# EAGLE design LPS25H_Breakout (EAGLE 7.4.0)
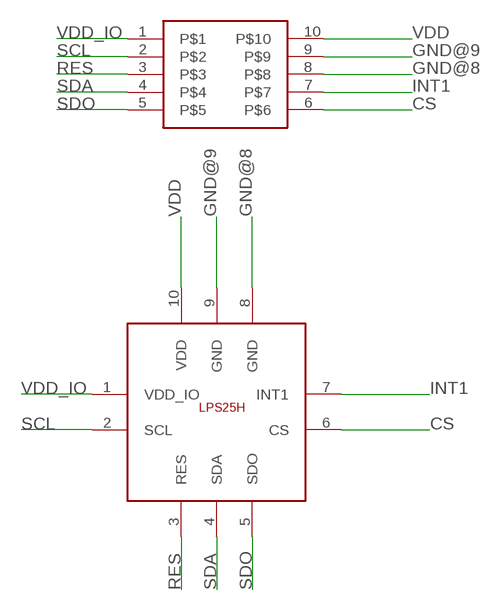
[diagram p0: schematic, sheet 1]

## Parts
U$1  ST-LPS25H  [ST-LPS25H]
U$2  10PIN  [10PIN]

## Nets
CS: U$1.6(CS) U$2.6
GND@8: U$1.8(GND) U$2.8
GND@9: U$1.9(GND) U$2.9
INT1: U$1.7(INT1) U$2.7
RES: U$1.3(RES) U$2.3
SCL: U$1.2(SCL) U$2.2
SDA: U$1.4(SDA) U$2.4
SDO: U$1.5(SDO) U$2.5
VDD: U$1.10(VDD) U$2.10
VDD_IO: U$1.1(VDD_IO) U$2.1

## Library data of the parts
U$1 = FaBo-Mems:ST-LPS25H
U$2 = FaBo-Breakout:10PIN

## Board
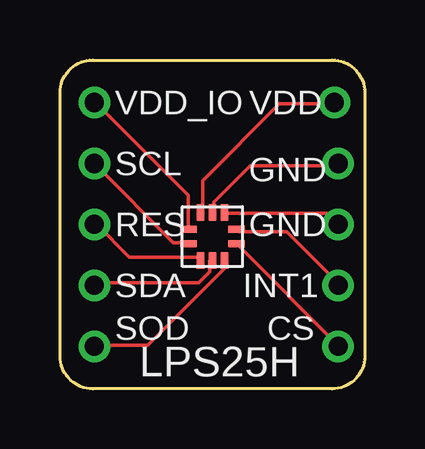
[diagram p1: board, top side]
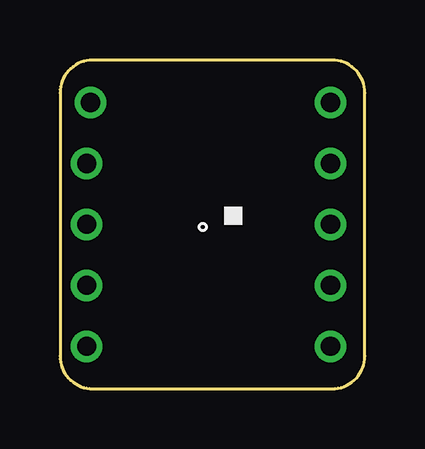
[diagram p2: board, bottom side, seen from below]

Size 12.7 x 13.7 mm. Coordinates in mm from the lower left corner, seen from the top.
Copper layers (1*16): Top 0.035mm / dielectric 1.5mm / Bottom 0.035mm
Design rules "SeeedStudio_2layer_DRU_no_angle_20140221": minimum track width 6mil, minimum drill 12mil, track to track 6mil, track to pad 6mil, pad to pad 6mil, via to via 6mil, smd to smd 0mil, copper to edge 10mil, drill to drill 10mil, minimum pad ring 10mil, minimum via ring 6mil, stop-mask expansion 2mil, vias tented up to drill 100mil, thermal gap 10mil

### Footprints (pad centres in the part's own frame; a part is rotated, then mirrored left to right if it is on the bottom)
ST-LPS25H = smd 0.3 x 0.7: 1 -0.3,-1; 2 0.3,-1; 6 0.3,1; 7 -0.3,1 | smd 0.7 x 0.3: 3 1,-0.5; 4 1,0; 5 1,0.5; 8 -1,0.5; 9 -1,0; 10 -1,-0.5
10PIN = drill 0.8: 1 -4.92,1.27; 2 -4.92,-1.27; 3 -4.92,-3.81; 4 -4.92,-6.35; 5 -4.92,-8.89; 6 5.24,-8.89; 7 5.24,-6.35; 8 5.24,-3.81; 9 5.24,-1.27; 10 5.08,1.27

### Placement (x,y rotation side)
U$1  6.35,6.34 270 top
U$2  6.35,10.66 0 top

### Tracks (layer width: path | path; a pad name or v marks a point on that pad's centre or on a via)
CS
  Top 0.152: U$1.6 7.47,5.94 11.58,1.82 U$2.6
GND@8
  Top 0.152: U$1.8 6.86,7.31 11.12,7.31 U$2.8
GND@9
  Top 0.152: U$1.9 6.4,7.46 6.4,7.76 7.92,9.29 11.58,9.29 U$2.9
INT1
  Top 0.152: U$1.7 7.47,6.55 9.45,6.55 11.58,4.41 U$2.7
RES
  Top 0.152: U$1.3 5.79,5.48 2.9,5.48 1.52,6.85 U$2.3
SCL
  Top 0.152: U$1.2 5.33,6.09 4.72,6.09 1.52,9.29 U$2.2
SDA
  Top 0.152: U$1.4 6.25,5.33 6.25,4.87 5.79,4.41 1.52,4.41 U$2.4
SDO
  Top 0.152: U$1.5 6.86,5.33 6.86,5.02 3.66,1.82 1.52,1.82 U$2.5
VDD
  Top 0.152: U$1.10 5.94,7.46 5.94,8.68 9.14,11.88 11.43,11.88 U$2.10
VDD_IO
  Top 0.152: U$1.1 5.33,6.7 5.33,8.07 1.52,11.88 U$2.1

### Text on the board
tPlace: VDD_IO | VDD | SCL | GND | RES | GND | SDA | INT1 | SOD | CS | LPS25H